# Altium project UZ_D_Resolver.PrjPCB (part 2 of 2)

## Sheet Resolver fuses.SchDoc
size A4; Author: M. Bauer / A. Geiger; CompanyName: Technische Hochschule Nürnberg Georg Simon Ohm; DrawnBy: Bauer Martin; Engineer: Bauer Martin; Organization: UltraZohm; Address1: Kesslerplatz 12; Address2: 90489 Nürnberg; Address3: GERMANY; DocumentNumber: 4; SheetNumber: 6; SheetTotal: 6; Website: www.ultrazohm.com
Used 3 times, as channels U_Resolver1/U_Resolver fuses, U_Resolver2/U_Resolver fuses, U_Resolver3/U_Resolver fuses. Parts and nets are listed once, with the designators drawn on the sheet.
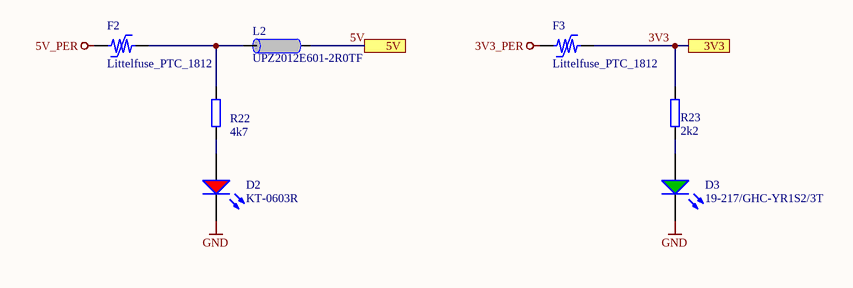
[diagram p5: Resolver fuses.SchDoc]

### Parts
D2  KT-0603R  [WL-SMCW_0603]
D3  19-217/GHC-YR1S2/3T  [WL-SMCW_0603]
F2  Littelfuse_PTC_1812  [1812_PTC_Polyfuse_Littelfuse]
F3  Littelfuse_PTC_1812  [1812_PTC_Polyfuse_Littelfuse]
L2  UPZ2012E601-2R0TF  [INDC2012X92N_V]
R22  4k7  [RES 0603_1608]
R23  2k2  [RES 0603_1608]

### Ports
3V3, 5V

### Nets
3V3_PER: F3.1
5V_PER: F2.1
GND: D2.1(K) D3.1(K)
3V3: F3.2 R23.2 ; port 3V3
5V: L2.1 ; port 5V
NetD2_2: D2.2(A) R22.1
NetD3_2: D3.2(A) R23.1
NetF2_2: F2.2 L2.2 R22.2

### Channels
U_Resolver1/U_Resolver fuses: designators end in A; ports 3V3=3V3_U_Resolver1 5V=5V_U_Resolver1
U_Resolver2/U_Resolver fuses: designators end in B; ports 3V3=3V3_U_Resolver2 5V=5V_U_Resolver2
U_Resolver3/U_Resolver fuses: designators end in C; ports 3V3=3V3_U_Resolver3 5V=5V_U_Resolver3

### Notes on the sheet
- Title
- Revision:
- Design Engineer:
- Date:
- Project:
- Sheet
- of

### Library data of the parts
D2 = KT-0603R: LED RED 520~625NM 90~100MCD@20MA TOP VIEW 0603 ROHS; Manufacturer: Hubei KENTO Elec; Type: Standard; Created from: T. Wendt; Forward Current I_f: 20 mA; Forward Voltage U_f: 2.1 V; Wavelength: 620 nm; Light Intensity: 110 mcd; Nominal Power: 42 mW; Manufacturer Part Number: KT-0603R; PartID: 8; Created On: 03.03.2021 10:06:23; ComponentLink1Description: Datasheet; ComponentLink1URL: https://datasheet.lcsc.com/szlcsc/Hubei-KENTO-Elec-KT-0603R_C2286.pdf; Component Type: LED Diode; Device Package: 0603; Last Updated: 04.03.2021 09:02:49; Mounting Type: SMD; Operating Temperature: -40 - 85 °C; Supplier 1: LCSC; Supplier Part Number 1: C2286; Live Cycle Status: 1; Stock number: not stored; Color: red; LCSC Part Number: C2286
D3 = 19-217/GHC-YR1S2/3T: LED GREEN 520~535NM 112~258MCD@20MA TOP VIEW 0603 ROHS; Manufacturer: Everlight Elec; Type: Standard; Created from: T. Wendt; Forward Current I_f: 20 mA; Forward Voltage U_f: 3.3 V; Wavelength: 530 nm; Light Intensity: 285 mcd; Nominal Power: 83 mW; Manufacturer Part Number: 19-217/GHC-YR1S2/3T; PartID: 7; Created On: 03.03.2021 10:06:23; ComponentLink1Description: Datasheet; ComponentLink1URL: https://datasheet.lcsc.com/szlcsc/Everlight-Elec-19-217-GHC-YR1S2-3T_C72043.pdf; Component Type: LED Diode; Device Package: 0603; Last Updated: 04.03.2021 09:02:49; Mounting Type: SMD; Operating Temperature: -40 - 85 °C; Supplier 1: LCSC; Supplier Part Number 1: C72043; Supplier 2: Mouser; Supplier Part Number 2: 638-19217GHCYR1S23T; Live Cycle Status: 1; Stock number: not stored; Color: green; LCSC Part Number: C72043
F2 F3 = Littelfuse_PTC_1812: POLYSWITCH RESETTABLE DEVICES; MPN: miniASMDC110F/24; Value: PTC, 1.1 A, 24V; Voltage: 24V; Trip Current: 2.2A; Hold Current: 1.1A; Resistance: 0.18 Ohm; Type: Fuse; Nominal current: 1 A; Created from: MHlatky; MF: Littelfuse; Created: 2019_02_10_AGeiger; Package: 1812; ComponentLink1URL: https://www.littelfuse.com/~/media/electronics/datasheets/resettable_ptcs/littelfuse_ptc_surface_mount_catalog_datasheet.pdf.pdf; ComponentLink1Description: Datasheet; Manufacturer Part Number: Littelfuse_PTC_1812; PartID: 5; Created On: 07.05.2021 06:50:33; Component Type: Littelfuse_PTC_1812; Last Updated: 27.05.2022 15:06:17; Manufacturer: Littelfuse; Mounting Type: SMD; Operating Temperature: -40 - 85 °C; Supplier 1: Mouser; Supplier Part Number 1: 530-0ZCG0150BF2C; Live Cycle Status: 1; LCSC Part Number: C70119
L2 = UPZ2012E601-2R0TF: 2A 1 90mΩ 600Ω@100MHz ±25% 0805  Ferrite Beads ROHS; Manufacturer: Sunlord; Value: 90 Ohm; Created from: AGeiger; Manufacturer Part Number: UPZ2012E601-2R0TF; PartID: 11; Created On: 03.09.2022 16:57:01; ComponentLink1Description: Datasheet; ComponentLink1URL: https://datasheet.lcsc.com/lcsc/2110091730_Sunlord-UPZ2012E601-2R0TF_C98308.pdf; Component Type: Ferrite Beads; Device Package: 0805; Last Updated: 03.09.2022 17:01:04; Mounting Type: SMD; Operating Temperature: -55 - 125 °C; Supplier 1: LCSC; Supplier Part Number 1: C98308; Type: Ferrite Bead; DC current: 2 A; Live Cycle Status: 1; LCSC Part Number: C98308
R22 = 0603WAF4701T5E: SMD resistor E24 series; Manufacturer: UNI-ROYAL; Tolerance: 1%; Created from: AGeiger; Value: 4k7; Supplier 1: LCSC; Supplier Part Number 1: C23162; Manufacturer Part Number: 0603WAF4701T5E; PartID: 90; Created On: 14.12.2020 16:17:14; ComponentLink1Description: Datasheet; ComponentLink1URL: https://datasheet.lcsc.com/lcsc/2206010116_UNI-ROYAL-Uniroyal-Elec-0603WAF4701T5E_C23162.pdf; Component Type: SMD resistor; Device Package: 0603; Last Updated: 25.08.2022 20:03:04; Mounting Type: SMD; Type: Resistor; Live Cycle Status: 1; Stock number: Labor SMD Container; LCSC Part Number: C23162
R23 = RK73B1JTTD222J: SMD resistor E24 series; Manufacturer: KOA Speer; Tolerance: 5%; Created from: MGremer; Value: 2k2; Supplier 1: Mouser; Supplier Part Number 1: 660-RK73B1JTTD222J; Manufacturer Part Number: RK73B1JTTD222J; PartID: 82; Created On: 14.12.2020 16:17:14; ComponentLink1Description: Datasheet; ComponentLink1URL: https://www.mouser.de/datasheet/2/219/RK73B-1825463.pdf; Component Type: SMD resistor; Device Package: 0603; Last Updated: 31.01.2023 21:49:41; Mounting Type: SMD; Type: Resistor; Live Cycle Status: 1; Stock number: Labor SMD Container; LCSC Part Number: C4190

## Nets that join several sheets
3V3_PER: DigitalCarrierJack (10 pins), U_Resolver1/U_Resolver fuses (F3A.1), U_Resolver2/U_Resolver fuses (F3B.1), U_Resolver3/U_Resolver fuses (F3C.1)
5V_PER: DigitalCarrierJack (X1.9 X1.10), U_Resolver1/U_Resolver fuses (F2A.1), U_Resolver2/U_Resolver fuses (F2B.1), U_Resolver3/U_Resolver fuses (F2C.1)
GND: DigitalCarrierJack (51 pins), U_Resolver1 (20 pins), U_Resolver1/Buffer_EXC (C11A.2 U2A.1 X8A.2 X8A.4), U_Resolver1/Impedance Converter (18 pins), U_Resolver1/U_Resolver fuses (D2A.1 D3A.1), U_Resolver2 (20 pins), U_Resolver2/Buffer_EXC (C11B.2 U2B.1 X8B.2 X8B.4), U_Resolver2/Impedance Converter (18 pins), U_Resolver2/U_Resolver fuses (D2B.1 D3B.1), U_Resolver3 (20 pins), U_Resolver3/Buffer_EXC (C11C.2 U2C.1 X8C.2 X8C.4), U_Resolver3/Impedance Converter (18 pins), U_Resolver3/U_Resolver fuses (D2C.1 D3C.1)
VIN_fused: DigitalCarrierJack (F1.2 R6.2), U_Resolver1 (X3A.2), U_Resolver1/Buffer_EXC (C11A.1 U2A.2), U_Resolver2 (X3B.2), U_Resolver2/Buffer_EXC (C11B.1 U2B.2), U_Resolver3 (X3C.2), U_Resolver3/Buffer_EXC (C11C.1 U2C.2)
3V3_U_Resolver1: U_Resolver1 (14 pins), U_Resolver1/U_Resolver fuses (F3A.2 R23A.2)
3V3_U_Resolver2: U_Resolver2 (14 pins), U_Resolver2/U_Resolver fuses (F3B.2 R23B.2)
3V3_U_Resolver3: U_Resolver3 (14 pins), U_Resolver3/U_Resolver fuses (F3C.2 R23C.2)
5V_U_Resolver1: U_Resolver1 (7 pins), U_Resolver1/Impedance Converter (6 pins), U_Resolver1/U_Resolver fuses (L2A.1)
5V_U_Resolver2: U_Resolver2 (7 pins), U_Resolver2/Impedance Converter (6 pins), U_Resolver2/U_Resolver fuses (L2B.1)
5V_U_Resolver3: U_Resolver3 (7 pins), U_Resolver3/Impedance Converter (6 pins), U_Resolver3/U_Resolver fuses (L2C.1)
~{Reset_Resolver}: DigitalCarrierJack (X1.25), U_Resolver1 (R21A.1 U1A.33)
~{Reset_Resolver}: DigitalCarrierJack (X1.42), U_Resolver2 (R21B.1 U1B.33)
~{Reset_Resolver}: DigitalCarrierJack (X1.61), U_Resolver3 (R21C.1 U1C.33)
~{Resolver_CS}: DigitalCarrierJack (X1.30), U_Resolver1 (R9A.1 U1A.2)
~{Resolver_CS}: DigitalCarrierJack (X1.49), U_Resolver2 (R9B.1 U1B.2)
~{Resolver_CS}: DigitalCarrierJack (X1.66), U_Resolver3 (R9C.1 U1C.2)
A0_Resolver1: DigitalCarrierJack (X1.29), U_Resolver1 (R17A.1 R18A.2 TP1A.1 U1A.37)
A0_Resolver2: DigitalCarrierJack (X1.46), U_Resolver2 (R17B.1 R18B.2 TP1B.1 U1B.37)
A0_Resolver3: DigitalCarrierJack (X1.65), U_Resolver3 (R17C.1 R18C.2 TP1C.1 U1C.37)
A1_Resolver1: DigitalCarrierJack (X1.26), U_Resolver1 (R19A.1 R20A.2 TP2A.1 U1A.36)
A1_Resolver2: DigitalCarrierJack (X1.45), U_Resolver2 (R19B.1 R20B.2 TP2B.1 U1B.36)
A1_Resolver3: DigitalCarrierJack (X1.62), U_Resolver3 (R19C.1 R20C.2 TP2C.1 U1C.36)
COS_LO_ST: U_Resolver1 (X5A.6), U_Resolver1/Impedance Converter (C19A.1 R45A.1 X9A.4)
COS_LO_ST: U_Resolver2 (X5B.6), U_Resolver2/Impedance Converter (C19B.1 R45B.1 X9B.4)
COS_LO_ST: U_Resolver3 (X5C.6), U_Resolver3/Impedance Converter (C19C.1 R45C.1 X9C.4)
COS_LO_U_Resolver1: U_Resolver1 (TP4A.1 U1A.44), U_Resolver1/Impedance Converter (C28A.1 R49A.2)
COS_LO_U_Resolver2: U_Resolver2 (TP4B.1 U1B.44), U_Resolver2/Impedance Converter (C28B.1 R49B.2)
COS_LO_U_Resolver3: U_Resolver3 (TP4C.1 U1C.44), U_Resolver3/Impedance Converter (C28C.1 R49C.2)
COS_ST: U_Resolver1 (X5A.2), U_Resolver1/Impedance Converter (C18A.1 R44A.1 X9A.3)
COS_ST: U_Resolver2 (X5B.2), U_Resolver2/Impedance Converter (C18B.1 R44B.1 X9B.3)
COS_ST: U_Resolver3 (X5C.2), U_Resolver3/Impedance Converter (C18C.1 R44C.1 X9C.3)
COS_U_Resolver1: U_Resolver1 (TP3A.1 U1A.45), U_Resolver1/Impedance Converter (C27A.1 R48A.2)
COS_U_Resolver2: U_Resolver2 (TP3B.1 U1B.45), U_Resolver2/Impedance Converter (C27B.1 R48B.2)
COS_U_Resolver3: U_Resolver3 (TP3C.1 U1C.45), U_Resolver3/Impedance Converter (C27C.1 R48C.2)
D_EXC_N_U_Resolver1: U_Resolver1 (X5A.9), U_Resolver1/Buffer_EXC (5 pins)
D_EXC_N_U_Resolver2: U_Resolver2 (X5B.9), U_Resolver2/Buffer_EXC (5 pins)
D_EXC_N_U_Resolver3: U_Resolver3 (X5C.9), U_Resolver3/Buffer_EXC (5 pins)
D_EXC_U_Resolver1: U_Resolver1 (X5A.4), U_Resolver1/Buffer_EXC (5 pins)
D_EXC_U_Resolver2: U_Resolver2 (X5B.4), U_Resolver2/Buffer_EXC (5 pins)
D_EXC_U_Resolver3: U_Resolver3 (X5C.4), U_Resolver3/Buffer_EXC (5 pins)
D_SIN_LO_U_Resolver1: U_Resolver1 (X5A.7), U_Resolver1/Impedance Converter (C16A.1 R42A.1 X9A.2)
D_SIN_LO_U_Resolver2: U_Resolver2 (X5B.7), U_Resolver2/Impedance Converter (C16B.1 R42B.1 X9B.2)
D_SIN_LO_U_Resolver3: U_Resolver3 (X5C.7), U_Resolver3/Impedance Converter (C16C.1 R42C.1 X9C.2)
D_SIN_U_Resolver1: U_Resolver1 (X5A.3), U_Resolver1/Impedance Converter (C17A.1 R43A.1 X9A.1)
D_SIN_U_Resolver2: U_Resolver2 (X5B.3), U_Resolver2/Impedance Converter (C17B.1 R43B.1 X9B.1)
D_SIN_U_Resolver3: U_Resolver3 (X5C.3), U_Resolver3/Impedance Converter (C17C.1 R43C.1 X9C.1)
DIG_IO_00: DigitalCarrierJack (X1.17), U_Resolver1 (R14A.1 U1A.10)
DIG_IO_01: DigitalCarrierJack (X1.18), U_Resolver1 (U1A.12)
DIG_IO_02: DigitalCarrierJack (X1.21), U_Resolver1 (U1A.4)
DIG_IO_03: DigitalCarrierJack (X1.22), U_Resolver1 (U1A.13)
DIG_IO_08: DigitalCarrierJack (X1.33), U_Resolver1 (U1A.11)
DIG_IO_09: DigitalCarrierJack (X1.34), U_Resolver2 (R14B.1 U1B.10)
DIG_IO_10: DigitalCarrierJack (X1.37), U_Resolver2 (U1B.12)
DIG_IO_11: DigitalCarrierJack (X1.38), U_Resolver2 (U1B.4)
DIG_IO_12: DigitalCarrierJack (X1.41), U_Resolver2 (U1B.13)
DIG_IO_17: DigitalCarrierJack (X1.50), U_Resolver2 (U1B.11)
DIG_IO_18: DigitalCarrierJack (X1.53), U_Resolver3 (R14C.1 U1C.10)
DIG_IO_19: DigitalCarrierJack (X1.54), U_Resolver3 (U1C.12)
DIG_IO_20: DigitalCarrierJack (X1.57), U_Resolver3 (U1C.4)
DIG_IO_21: DigitalCarrierJack (X1.58), U_Resolver3 (U1C.13)
DIG_IO_26: DigitalCarrierJack (X1.69), U_Resolver3 (U1C.11)
EXC_U_Resolver1: U_Resolver1 (TP7A.1 U1A.38), U_Resolver1/Buffer_EXC (R27A.2 X6A.1)
EXC_U_Resolver2: U_Resolver2 (TP7B.1 U1B.38), U_Resolver2/Buffer_EXC (R27B.2 X6B.1)
EXC_U_Resolver3: U_Resolver3 (TP7C.1 U1C.38), U_Resolver3/Buffer_EXC (R27C.2 X6C.1)
GND_EXC_U_Resolver1: U_Resolver1 (6 pins), U_Resolver1/Buffer_EXC (11 pins)
GND_EXC_U_Resolver2: U_Resolver2 (6 pins), U_Resolver2/Buffer_EXC (11 pins)
GND_EXC_U_Resolver3: U_Resolver3 (6 pins), U_Resolver3/Buffer_EXC (11 pins)
N_EXC_U_Resolver1: U_Resolver1 (TP8A.1 U1A.39), U_Resolver1/Buffer_EXC (R26A.2 X6A.2)
N_EXC_U_Resolver2: U_Resolver2 (TP8B.1 U1B.39), U_Resolver2/Buffer_EXC (R26B.2 X6B.2)
N_EXC_U_Resolver3: U_Resolver3 (TP8C.1 U1C.39), U_Resolver3/Buffer_EXC (R26C.2 X6C.2)
SIN_LO_U_Resolver1: U_Resolver1 (TP6A.1 U1A.42), U_Resolver1/Impedance Converter (C25A.1 R46A.2)
SIN_LO_U_Resolver2: U_Resolver2 (TP6B.1 U1B.42), U_Resolver2/Impedance Converter (C25B.1 R46B.2)
SIN_LO_U_Resolver3: U_Resolver3 (TP6C.1 U1C.42), U_Resolver3/Impedance Converter (C25C.1 R46C.2)
SIN_U_Resolver1: U_Resolver1 (TP5A.1 U1A.41), U_Resolver1/Impedance Converter (C26A.1 R47A.2)
SIN_U_Resolver2: U_Resolver2 (TP5B.1 U1B.41), U_Resolver2/Impedance Converter (C26B.1 R47B.2)
SIN_U_Resolver3: U_Resolver3 (TP5C.1 U1C.41), U_Resolver3/Impedance Converter (C26C.1 R47C.2)

## Assembly variants
Default: not fitted J1 J3A J3B J3C J4A J4B J4C J5A J5B J5C J6A J6B J6C J7A J7B J7C J8A J8B J8C R1 R3A R3B R3C R4A R4B R4C R5A R5B R5C R7A R7B R7C R10A R10B R10C R11A R11B R11C R14A R14B R14C R15A R15B R15C R17A R17B R17C R19A R19B R19C R51A R51B R51C R? R?